# EAGLE design combined_pressure_sensor_rev0 (EAGLE 7.6.0)
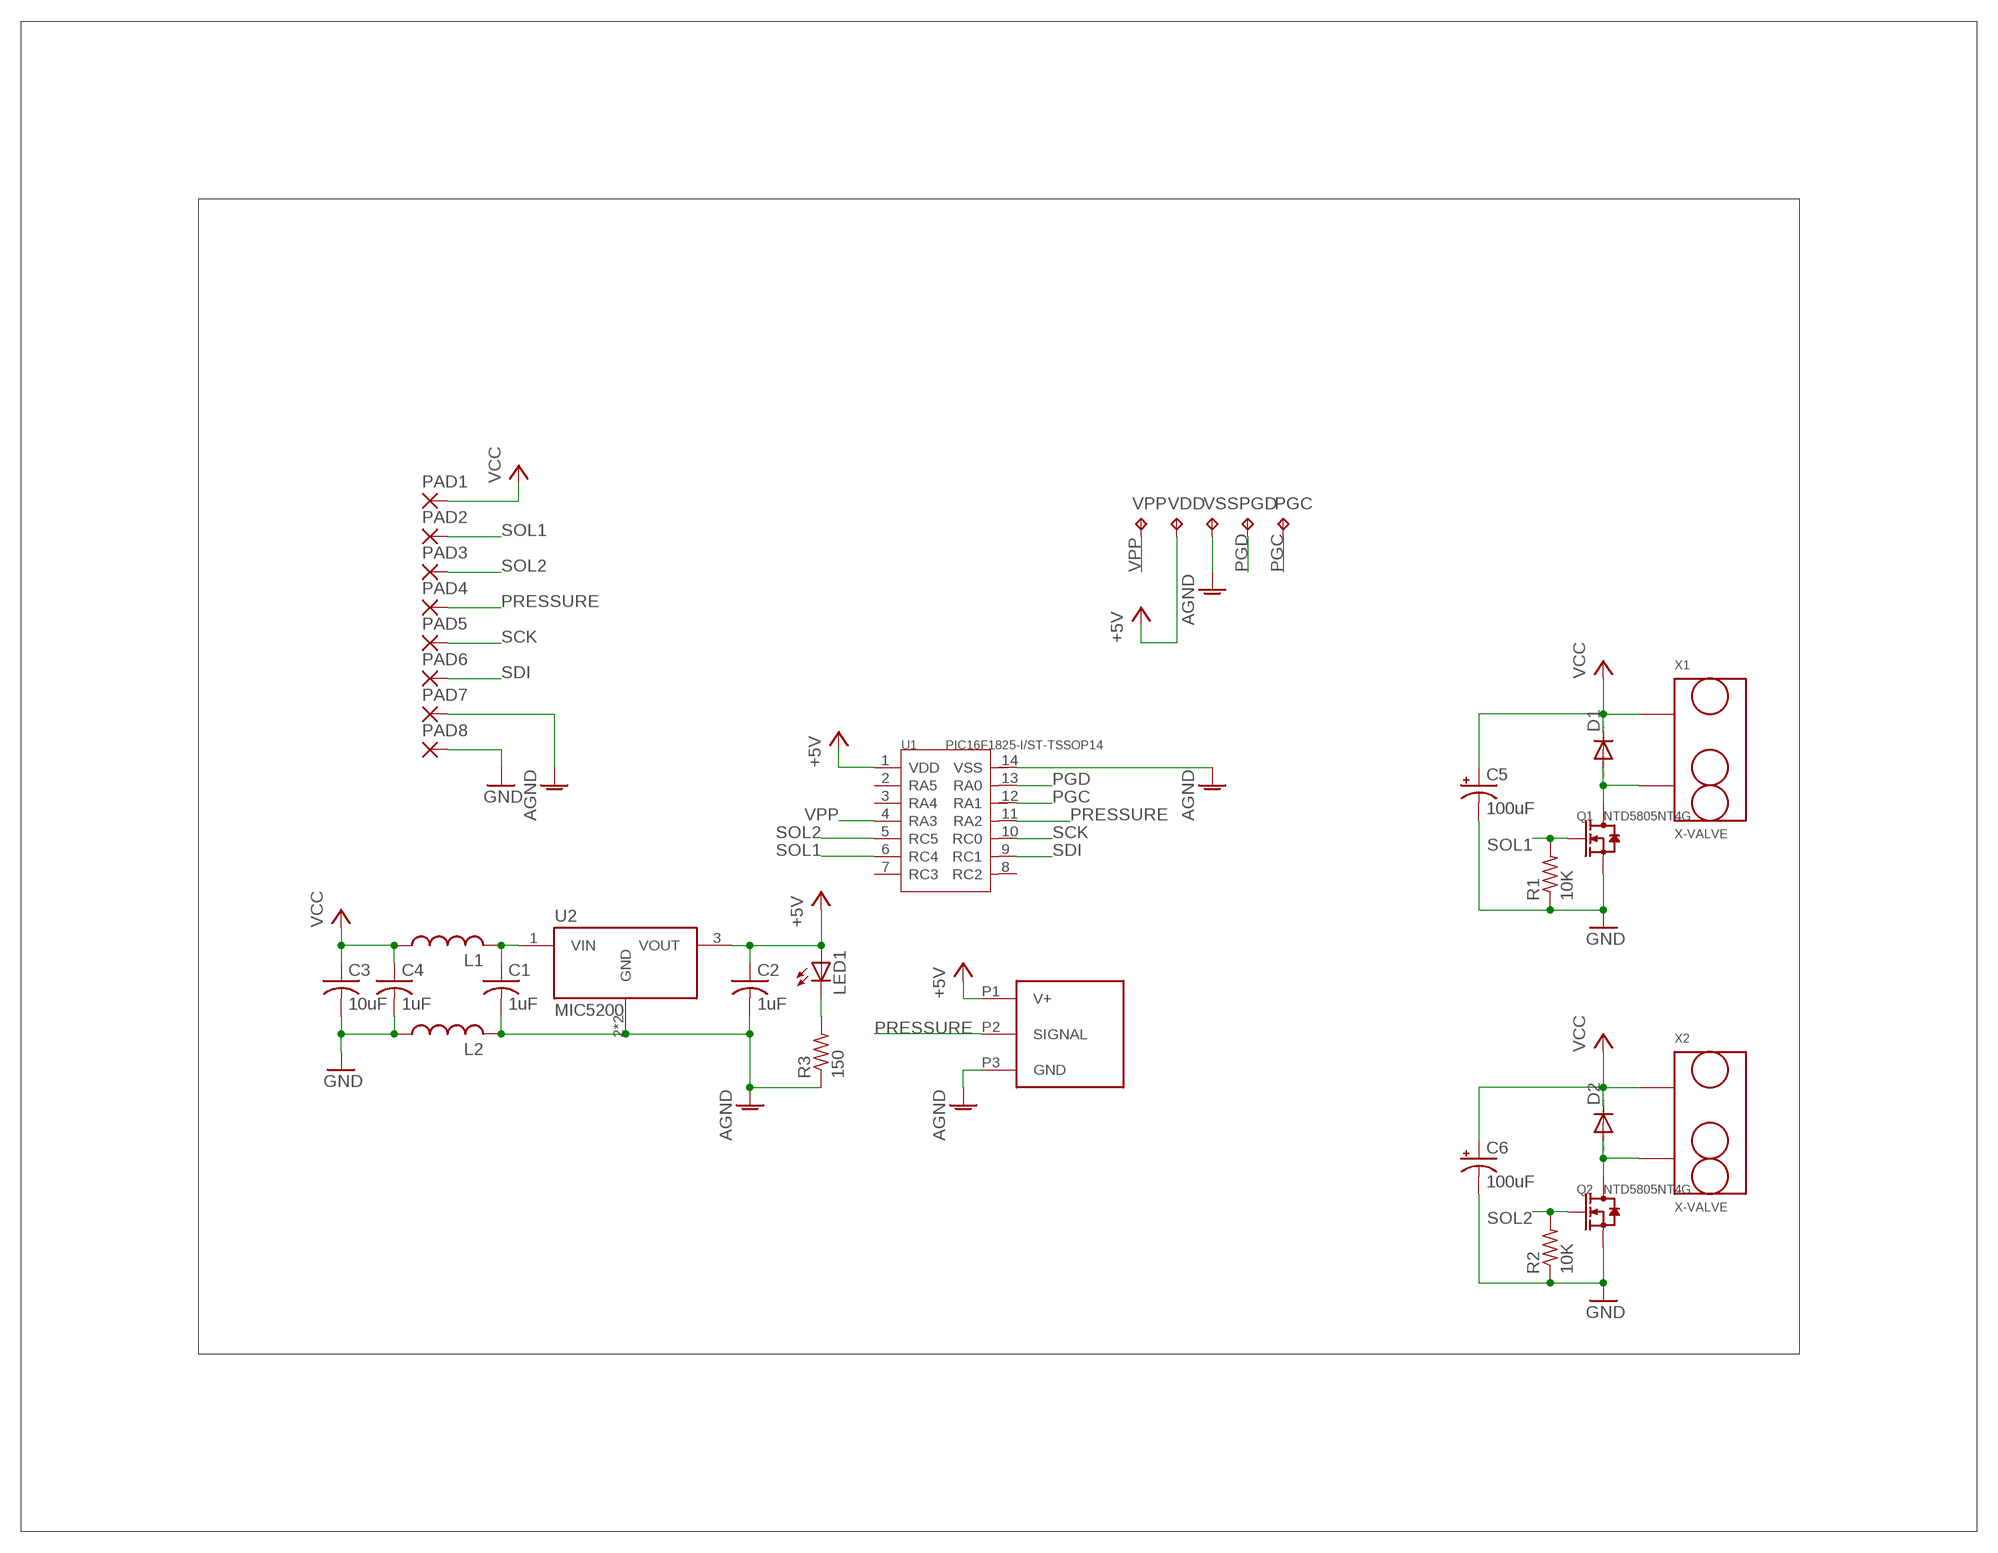
[diagram p0: schematic, sheet 1]

## Parts
C1  1uF  C-USC0603  [C0603]
C2  1uF  C-USC0603  [C0603]
C3  10uF  C-USC1206  [C1206]
C4  1uF  C-USC0603  [C0603]
C5  100uF  CPOL-US153CLV-0605  [153CLV-0605]
C6  100uF  CPOL-US153CLV-0605  [153CLV-0605]
D1  DIODE-SOD523  [SOD523]
D2  DIODE-SOD523  [SOD523]
L1  L-USL1206  [L1206]
L2  L-USL1206  [L1206]
LED1  LEDCHIP-LED0603  [CHIP-LED0603]
PAD1  SMD2  [SMD1,27-2,54]
PAD2  SMD2  [SMD1,27-2,54]
PAD3  SMD2  [SMD1,27-2,54]
PAD4  SMD2  [SMD1,27-2,54]
PAD5  SMD2  [SMD1,27-2,54]
PAD6  SMD2  [SMD1,27-2,54]
PAD7  SMD2  [SMD1,27-2,54]
PAD8  SMD2  [SMD1,27-2,54]
PGC  TPB1,27  [B1,27]
PGD  TPB1,27  [B1,27]
Q1  NTD5805NT4G  SMD-MOSFET-HIGH-POWER-N-CH-40V-51A-NTD5805NT4G(DPAK)  [DPAK]
Q2  NTD5805NT4G  SMD-MOSFET-HIGH-POWER-N-CH-40V-51A-NTD5805NT4G(DPAK)  [DPAK]
R1  10K  R-US_R0603  [R0603]
R2  10K  R-US_R0603  [R0603]
R3  150  R-US_R0603  [R0603]
U1  PIC16F1825-I/ST-TSSOP14  MCU-PIC16F1825-I/ST(TSSOP14)  [TSSOP14-0.65-5X4.4MM]
U2  MIC5200  [SOT223]
U$3  ASDX  [ASDX]
VDD  TPB1,27  [B1,27]
VPP  TPB1,27  [B1,27]
VSS  TPB1,27  [B1,27]
X1  X-VALVE  [X-VALVE]
X2  X-VALVE  [X-VALVE]

## Nets
+5V: C2.1 LED1.A U1.1(VDD) U2.3(VOUT) U$3.P1(V+) VDD.TP
AGND: C1.2 C2.2 L2.2 PAD7.1(P) R3.1 U1.14(VSS) U2.2(GND) U2.4(GND) U$3.P3(GND) VSS.TP
GND: C3.2 C4.2 C5.- C6.- L2.1 PAD8.1(P) Q1.2(S) Q2.2(S) R1.1 R2.1
N$1: D1.A Q1.3(D) X1.P$2
N$2: D2.A Q2.3(D) X2.P$2
N$3: C1.1 L1.2 U2.1(VIN)
N$6: LED1.C R3.2
PGC: PGC.TP U1.12(RA1)
PGD: PGD.TP U1.13(RA0)
PRESSURE: PAD4.1(P) U1.11(RA2) U$3.P2(SIGNAL)
SCK: PAD5.1(P) U1.10(RC0)
SDI: PAD6.1(P) U1.9(RC1)
SOL1: PAD2.1(P) Q1.1(G) R1.2 U1.6(RC4)
SOL2: PAD3.1(P) Q2.1(G) R2.2 U1.5(RC5)
VCC: C3.1 C4.1 C5.+ C6.+ D1.C D2.C L1.1 PAD1.1(P) X1.P$1 X2.P$1
VPP: U1.4(RA3) VPP.TP
Unconnected: U1.2(RA5) U1.3(RA4) U1.7(RC3) U1.8(RC2)

## Library data of the parts
C1-C4 = rcl:C-US: CAPACITOR, American symbol
C5 C6 = rcl:CPOL-US: POLARIZED CAPACITOR, American symbol
D1 D2 = diode:DIODE-: DIODE
L1 L2 = rcl:L-US: INDUCTOR, American symbol
LED1 = led:LED: LED OSRAM: - CHIPLED LG R971, LG N971, LY N971, LG Q971, LY Q971, LO R971, LY R971 LH N974, LH R974 LS Q976, LO Q976, LY Q976 LO Q996 - Hyper CHIPLED LW Q18S LB Q993, LB Q99A, LB R99A - SideLED LS A670, LO A670, LY A670, LG A670, LP A670 LB A673, LV A673, LT A673, LW A673 LH A674 LY A675 LS A676, LA A676, LO A676, LY A676, LW A676 LS A679, LY A679, LG A679 - Hyper Micro SIDELED® LS Y876, LA Y876, LO Y876, LY Y876 LT Y87S - SmartLED LW L88C, LW L88S LB L89C, LB L89S, LG L890 LS L89K, LO L89K, LY L89K LS L896, LA L896, LO L896, LY L896 - TOPLED LS T670, LO T670, LY T670, LG T670, LP T670 LSG T670, LSP T670, LSY T670, LOP T670, LYG T670 LG T671, LOG T671, LSG T671 LB T673, LV T673, LT T673, LW T673 LH T674 LS T676, LA T676, LO T676, LY T676, LB T676, LH T676, LSB T676, LW T676 LB T67C, LV T67C, LT T67C, LS T67K, LO T67K, LY T67K, LW E67C LS E67B, LA E67B, LO E67B, LY E67B, LB E67C, LV E67C, LT E67C LW T67C LS T679, LY T679, LG T679 LS T770, LO T770, LY T770, LG T770, LP T770 LB T773, LV T773, LT T773, LW T773 LH T774 LS E675, LA E675, LY E675, LS T675 LS T776, LA T776, LO T776, LY T776, LB T776 LHGB T686 LT T68C, LB T68C - Hyper Mini TOPLED® LB M676 - Mini TOPLED Santana® LG M470 LS M47K, LO M47K, LY M47K Source: http://www.osram.convergy.de LUXEON: - LUMILED® LXK2-PW12-R00, LXK2-PW12-S00, LXK2-PW14-U00, LXK2-PW14-V00 LXK2-PM12-R00, LXK2-PM12-S00, LXK2-PM14-U00 LXK2-PE12-Q00, LXK2-PE12-R00, LXK2-PE12-S00, LXK2-PE14-T00, LXK2-PE14-U00 LXK2-PB12-K00, LXK2-PB12-L00, LXK2-PB12-M00, LXK2-PB14-N00, LXK2-PB14-P00, LXK2-PB14-Q00 LXK2-PR12-L00, LXK2-PR12-M00, LXK2-PR14-Q00, LXK2-PR14-R00 LXK2-PD12-Q00, LXK2-PD12-R00, LXK2-PD12-S00 LXK2-PH12-R00, LXK2-PH12-S00 LXK2-PL12-P00, LXK2-PL12-Q00, LXK2-PL12-R00 Source: www.luxeon.com KINGBRIGHT: KA-3528ASYC Source: www.kingbright.com
PAD1-PAD8 = wirepad:SMD2: SMD PAD
PGC PGD VDD VPP VSS = testpad:TP: Test pad
Q1 Q2 = Seeed-OPL-Transistor:SMD-MOSFET-HIGH-POWER-N-CH-40V-51A-NTD5805NT4G(DPAK): 305030078; MPN: NTD5805NT4G
R1-R3 = rcl:R-US_: RESISTOR, American symbol
U1 = Seeed-OPL-ic:MCU-PIC16F1825-I/ST(TSSOP14): 310010120; MPN: PIC16F1825-I/ST
U2 = microchip:MIC5200: 100 mA Low-Dropout Regulator Features • High Output Voltage Accuracy • Variety of Output Voltages • Guaranteed 100 mA Output • Low Quiescent Current • Low Dropout Voltage • Extremely Tight Load and Line Regulation • Very Low Temperature Coefficient • Current and Thermal Limiting • Zero OFF Mode Current • Logic-Controlled Electronic Shutdown • Available in 8-Lead SOIC, MM8 8-Lead MSOP, and SOT-223 Packages
U$3 = honeywell_pressure_sensors:ASDX
X1 X2 = parker-valve:X-VALVE

## Board
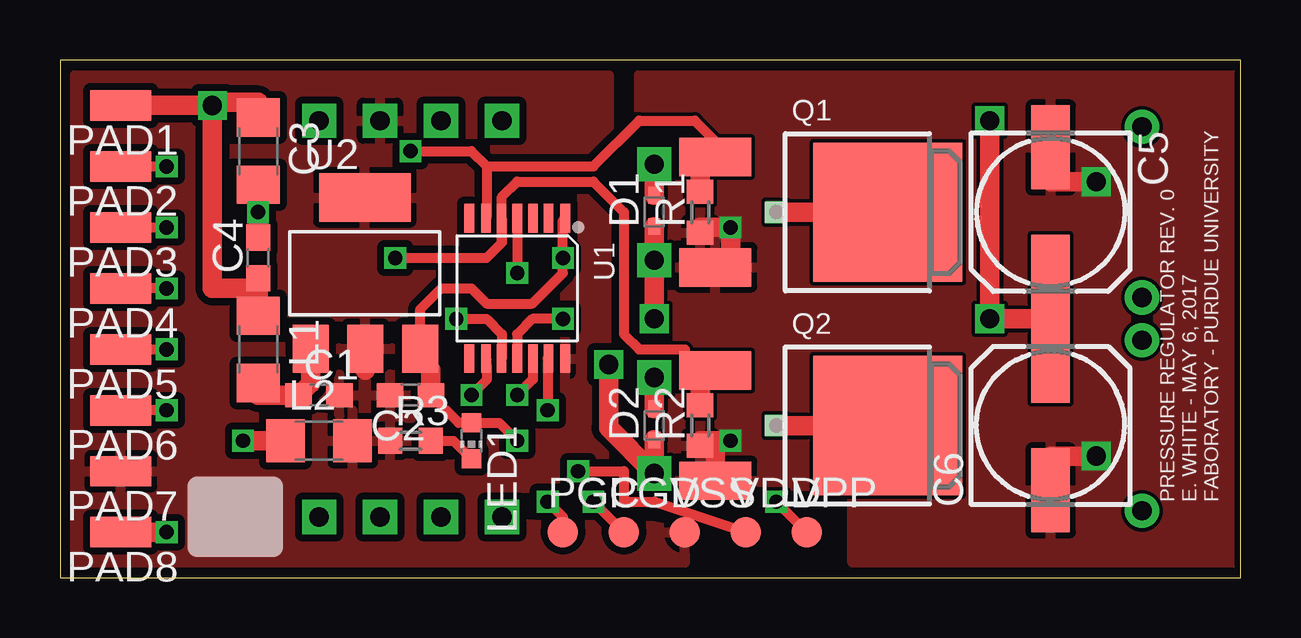
[diagram p1: board, top side]
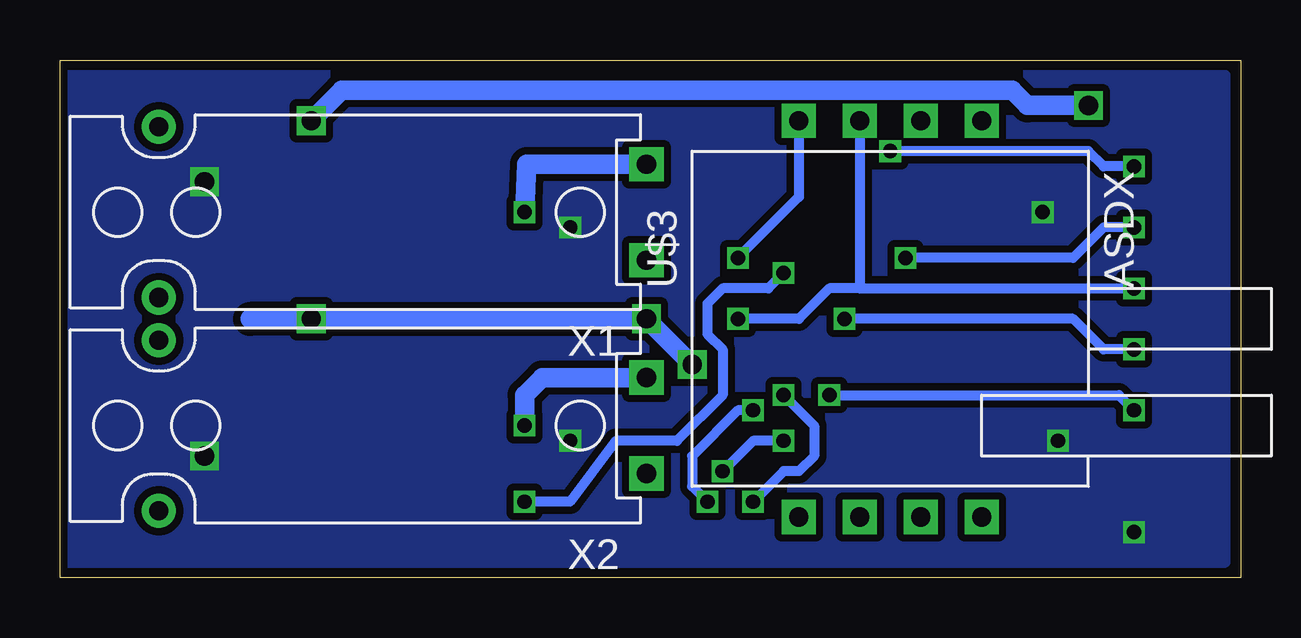
[diagram p2: board, bottom side, seen from below]

Size 49.2 x 21.58 mm. Coordinates in mm from the lower left corner, seen from the top.
Outline: 0,0 49.2,0 49.2,21.58 0,21.58 0,0
Copper layers (1*16): Top 0.035mm / dielectric 1.5mm / Bottom 0.035mm
Design rules "SeeedStudio_2layer_DRU_no_angle_20140221 *": minimum track width 6mil, minimum drill 12mil, track to track 6mil, track to pad 6mil, pad to pad 6mil, via to via 6mil, smd to smd 0mil, copper to edge 10mil, drill to drill 10mil, minimum pad ring 10mil, minimum via ring 6mil, stop-mask expansion 4mil, vias tented up to drill 100mil, thermal gap 10mil

### Footprints (pad centres in the part's own frame; a part is rotated, then mirrored left to right if it is on the bottom)
C0603 = smd 1.1 x 1: 1 -0.85,0; 2 0.85,0
C1206 = smd 1.6 x 1.8: 1 -1.4,0; 2 1.4,0
153CLV-0605 = smd 3.5 x 1.6: + 2.7,0; - -2.7,0
SOD523 = smd 0.7 x 0.5: A 0.7,0; C -0.6,0
L1206 = smd 1.6 x 1.8: 1 -1.4,0; 2 1.4,0
CHIP-LED0603 = smd 0.8 x 0.8: A 0,-0.75; C 0,0.75
SMD1,27-2,54 = smd 1.27 x 2.54: 1 0,0
B1,27 = smd 1.27 x 1.27: TP 0,0
DPAK = smd 3 x 1.6: 1 0,-2.3; 2 0,2.3 | smd 6.2 x 5.8: 3 -7.18,0
R0603 = smd 1 x 1.1: 1 -0.85,0; 2 0.85,0
TSSOP14-0.65-5X4.4MM = smd 0.4 x 1.2: 1 -2,-2.925; 2 -1.3,-2.925; 3 -0.65,-2.925; 4 0,-2.925; 5 0.65,-2.925; 6 1.3,-2.925; 7 2,-2.925; 8 2,2.925; 9 1.3,2.925; 10 0.65,2.925; 11 0,2.925; 12 -0.65,2.925; 13 -1.3,2.925; 14 -2,2.925
SOT223 = smd 1.499 x 2.007: 1 -2.261,-3.15; 2 0.025,-3.15; 3 2.311,-3.15 | smd 3.81 x 2.007: 4 0,3.15
ASDX = drill 0.8 pad 1.422 square: P1 8.255,3.81; P2 8.255,1.27; P3 8.255,-1.27; P4 8.255,-3.81; P5 -8.255,3.81; P6 -8.255,1.27; P7 -8.255,-1.27; P8 -8.255,-3.81
X-VALVE = drill 0.8 pad 1.422 square: P$1 0,2; P$2 0,-2 | drill 0.8 pad 1.422: P$3 20.32,3.556; P$4 20.32,-3.556

### Placement (x,y rotation side)
C1  10.79,7.62 0 top
C2  14.61,7.62 180 top
C3  8.26,17.78 270 top
C4  8.26,13.34 90 top
C5  41.27,15.24 270 top
C6  41.27,6.35 90 top
D1  24.77,15.24 90 top
D2  24.77,6.35 90 top
L1  8.26,9.53 270 top
L2  10.79,5.71 0 top
LED1  17.14,5.71 180 top
PAD1  2.54,19.68 90 top
PAD2  2.54,17.14 90 top
PAD3  2.54,14.61 90 top
PAD4  2.54,12.06 90 top
PAD5  2.54,9.53 90 top
PAD6  2.54,6.99 90 top
PAD7  2.54,4.45 90 top
PAD8  2.54,1.91 90 top
PGC  20.95,1.91 0 top
PGD  23.5,1.91 0 top
Q1  27.3,15.24 180 top
Q2  27.3,6.35 180 top
R1  26.67,15.24 90 top
R2  26.67,6.35 90 top
R3  14.61,5.71 0 top
U1  19.05,12.06 180 top
U2  12.7,12.7 0 top
U$3  14.61,10.79 90 bottom
VDD  28.57,1.91 0 top
VPP  31.11,1.91 0 top
VSS  26.04,1.91 0 top
X1  24.77,15.24 180 bottom
X2  24.77,6.35 180 bottom

### Tracks (layer width: path | path; a pad name or v marks a point on that pad's centre or on a via)
+5V  (via drill 0.6)
  Top 0.406: 14.82,9.55 U2.3 15.01,11.2 15.88,12.06 17.14,12.06 17.78,11.43 19.68,11.43 20.95,12.7 v20.95,13.34 20.95,14.89 U1.1 | v21.59,4.45 23.5,4.45 23.5,3.17 24.77,3.17 VDD.TP | v19.05,5.71 18.3,6.46 LED1.A 16.61,6.46 C2.1
  Top 0.813: 14.82,9.55 15.24,8.89 15.46,8.68 C2.1
  Bottom 0.406: U$3.P1 18.41,15.88 v20.95,13.34 | v19.05,5.71 20.32,5.71 v21.59,4.45
AGND
  Top 0.406: U2.4 12.72,15.85
  Top 0.813: U2.2 12.72,8.65
  pour Top (isolate 0.305): 22.86,20.95 22.86,2.54 26.04,1.91 26.04,0.64 0.64,0.64 0.64,20.95
GND  (via drill 0.6, 0.8)
  Top 0.813: R1.1 26.67,14.61 v27.94,14.61 27.94,13.34 Q1.2 27.94,12.7 | 27.3,5.71 Q2.2 | R2.1 26.67,5.71 27.3,5.71 | 27.3,5.71 v27.94,5.71 | PAD8.1 v4.45,1.91 | 9.53,5.71 L2.1 v7.62,5.71 | C3.2 v8.26,15.24 C4.2 | C5.- 41.27,16.51 v43.18,16.51 | C6.- 41.27,5.08 v43.18,5.08
  pour Bottom (isolate 0.305): 48.9,20.95 48.9,0.64 0.64,0.64 0.64,20.95
  pour Top: 24.13,20.95 48.9,20.95 48.9,0.64 33.02,0.64 33.02,3.81 24.13,3.81
N$1  (via drill 0.6)
  Top 0.813: v29.84,15.24 Q1.3 | X1.P$2 D1.A
  Bottom 0.813: X1.P$2 29.75,17.24 v29.84,15.24
N$2  (via drill 0.6)
  Top 0.813: v29.84,6.35 Q2.3 | X2.P$2 D2.A
  Bottom 0.813: X2.P$2 29.11,8.35 29.84,7.62 v29.84,6.35
N$3
  Top 0.813: U2.1 10.44,8.11 C1.1 8.26,7.62 L1.2
N$6
  Top 0.406: 15.24,5.71 R3.2 16.39,5.71 LED1.C
PGC  (via drill 0.6)
  Top 0.406: U1.12 19.7,8.27 v19.05,7.62 | v20.32,3.17 20.95,2.54 PGC.TP
  Bottom 0.406: v19.05,7.62 17.78,6.35 17.78,5.08 18.41,4.45 19.05,4.45 v20.32,3.17
PGD  (via drill 0.6)
  Top 0.406: v22.23,3.17 PGD.TP | U1.13 20.32,9.14 v20.32,6.99 20.35,7.01
  Bottom 0.406: v20.32,6.99 20.95,6.99 22.86,5.08 22.86,3.81 v22.23,3.17
PRESSURE  (via drill 0.6)
  Top 0.406: v4.45,12.06 PAD4.1 | v20.95,10.79 19.68,10.79 19.05,10.16 U1.11
  Bottom 0.406: U$3.P2 15.88,12.06 | 15.88,12.06 v4.45,12.06 | 15.88,12.06 17.14,12.06 18.41,10.79 v20.95,10.79
SCK  (via drill 0.6)
  Top 0.406: PAD5.1 v4.45,9.53 | v16.51,10.79 17.78,10.79 18.41,10.16 18.41,9.15 U1.10
  Bottom 0.406: v4.45,9.53 5.71,9.53 6.99,10.79 v16.51,10.79
SDI  (via drill 0.6)
  Top 0.406: U1.9 17.75,8.86 17.78,8.89 17.78,8.26 v17.14,7.62 | v4.45,6.99 PAD6.1
  Bottom 0.406: v17.14,7.62 5.08,7.62 v4.45,6.99
SOL1  (via drill 0.6)
  Top 0.406: 17.78,17.14 22.23,17.14 24.13,19.05 26.45,19.05 27.73,17.78 26.67,17.78 | PAD2.1 v4.45,17.14 | v14.61,17.78 17.14,17.78 17.78,17.14 | 17.78,17.14 17.78,15.02 U1.6
  Top 0.813: R1.2 26.67,17.78 27.3,17.78 Q1.1
  Bottom 0.406: v4.45,17.14 5.71,17.14 6.35,17.78 v14.61,17.78
SOL2  (via drill 0.6)
  Top 0.406: U1.5 18.4,13.98 18.41,13.97 | 18.41,13.97 17.78,13.34 v13.97,13.34 | PAD3.1 v4.45,14.61 | 18.41,13.97 18.41,15.88 19.05,16.51 22.23,16.51 23.5,15.24 23.5,10.16 24.13,9.53 26.04,9.53 26.04,8.89 26.43,8.89 Q2.1
  Top 0.813: Q2.1 26.67,8.65 R2.2
  Bottom 0.406: v4.45,14.61 5.71,14.61 6.99,13.34 v13.97,13.34
VCC  (via drill 0.8)
  Top 0.813: PAD1.1 v6.35,19.68 | v24.77,10.79 X1.P$1 D1.C | v6.35,19.68 6.35,19.82 8.26,19.82 C3.1 | v22.86,8.89 22.86,6.25 X2.P$1 D2.C | v38.73,19.05 v38.73,10.79 41.27,10.79 | 41.27,10.79 C5.+ | C6.+ 41.27,10.79 | v6.35,19.68 6.35,12.06 8.26,12.06 C4.1 L1.1
  Bottom 0.813: v6.35,19.68 8.89,19.68 9.53,20.32 37.47,20.32 v38.73,19.05 | v22.86,8.89 v24.77,10.79 v38.73,10.79 41.27,10.79
VPP  (via drill 0.6)
  Top 0.406: U1.4 v19.05,12.7 | v29.84,3.17 VPP.TP
  Bottom 0.406: v19.05,12.7 19.68,12.06 21.59,12.06 22.23,11.43 22.23,10.16 21.59,9.53 21.59,7.62 23.5,5.71 26.04,5.71 27.94,3.17 v29.84,3.17

### Text on the board
top_silk: PRESSURE REGULATOR REV. 0 / E. WHITE - MAY 6, 2017 / FABORATORY - PURDUE UNIVERSITY